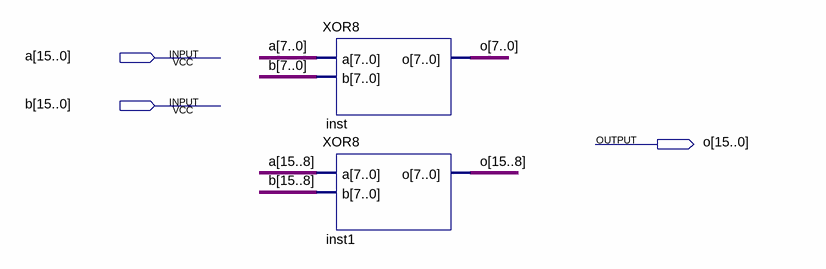
[diagram p0: schematic sheet]
// Quartus schematic XOR16.bdf as structural Verilog: 2 symbols, 3 pins
module XOR16 (
  input  [15:0] a,
  input  [15:0] b,
  output [15:0] o
);

  XOR8 inst (.a(a[7:0]), .b(b[7:0]), .o(o[7:0]));
  XOR8 inst1 (.a(a[15:8]), .b(b[15:8]), .o(o[15:8]));
endmodule
